# EAGLE design load-it (EAGLE 6.2)
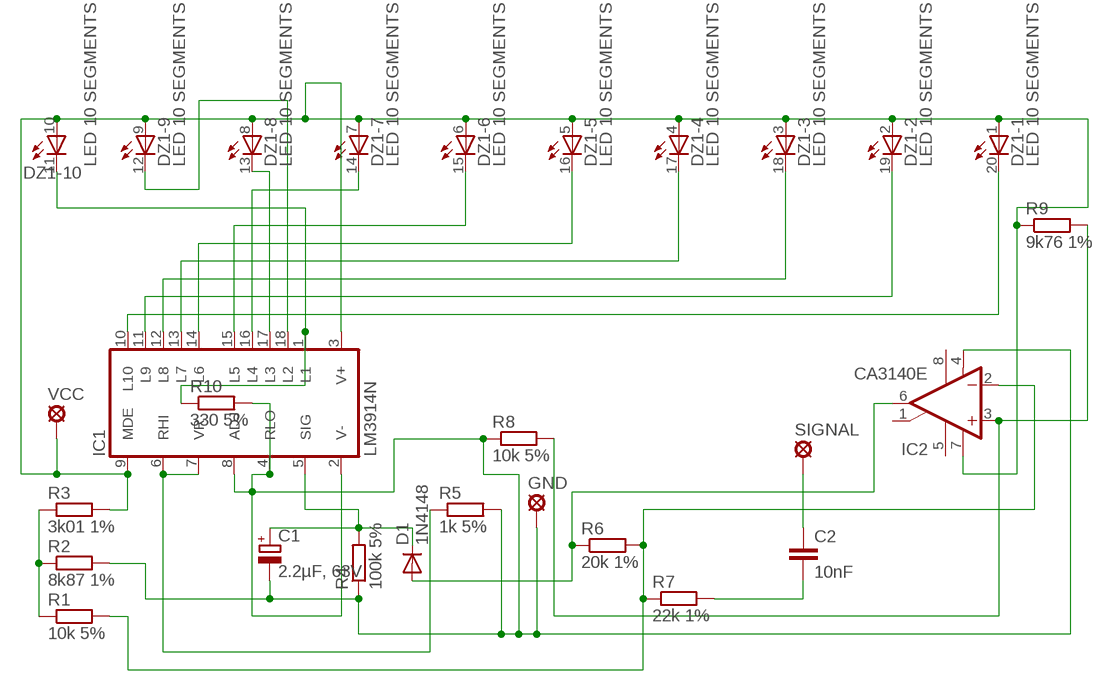
[diagram p0: schematic, sheet 1]

## Parts
C1  2.2µF, 63V  CPOL-EUE5-6  [E5-6]
C2  10nF  C2.5/2  [C2.5-2]
D1  1N4148  1N4148DO35-7  [DO35-7]
DZ1  LED 10 SEGMENTS  LB10  [LB10]
GND  GND  LSP10  [LSP10]
IC1  LM3914N  [DIL18]
IC2  CA3140E  CA3140N  [DIL08]
R1  10k 5%  R-EU_0207/10  [0207/10]
R2  8k87 1%  R-EU_0207/10  [0207/10]
R3  3k01 1%  R-EU_0207/10  [0207/10]
R4  100k 5%  R-EU_0207/10  [0207/10]
R5  1k 5%  R-EU_0207/10  [0207/10]
R6  20k 1%  R-EU_0207/10  [0207/10]
R7  22k 1%  R-EU_0207/10  [0207/10]
R8  10k 5%  R-EU_0207/10  [0207/10]
R9  9k76 1%  R-EU_0207/10  [0207/10]
R10  330 5%  R-EU_0207/10  [0207/10]
SIGNAL  SG  LSP10  [LSP10]
VCC  VCC  LSP10  [LSP10]

## Nets
N$1: DZ1.20(-1:C) IC1.10(L10)
N$2: IC2.2(-IN) R1.2 R6.2 R7.1
N$3: D1.A IC2.6(OUT) R6.1
N$5: IC2.3(+IN) R8.2 R9.2
N$7: C1.- GND.MP IC1.2(V-) IC1.4(RLO) IC1.8(ADJ) IC2.4(V-) R2.2 R4.1 R5.2 R8.1 R10.2
N$8: DZ1.1(-1:A) DZ1.2(-2:A) DZ1.3(-3:A) DZ1.4(-4:A) DZ1.5(-5:A) DZ1.6(-6:A) DZ1.7(-7:A) DZ1.8(-8:A) DZ1.9(-9:A) DZ1.10(-10:A) IC1.3(V+) IC1.9(MDE) IC2.7(V+) R3.2 R9.1 VCC.MP
N$9: C1.+ D1.C IC1.5(SIG) R4.2
N$10: IC1.6(RHI) IC1.7(VR) R5.1
N$11: DZ1.11(-10:C) IC1.1(L1) R10.1
N$12: DZ1.19(-2:C) IC1.11(L9)
N$13: DZ1.18(-3:C) IC1.12(L8)
N$14: DZ1.17(-4:C) IC1.13(L7)
N$15: DZ1.16(-5:C) IC1.14(L6)
N$16: DZ1.15(-6:C) IC1.15(L5)
N$17: DZ1.14(-7:C) IC1.16(L4)
N$18: DZ1.13(-8:C) IC1.17(L3)
N$19: DZ1.12(-9:C) IC1.18(L2)
N$20: R1.1 R2.1 R3.1
N$23: C2.2 R7.2
N$24: C2.1 SIGNAL.MP
Unconnected: IC2.1(ON/CMP) IC2.5(ON) IC2.8(CMP)

## Library data of the parts
C1 = rcl:CPOL-EU: POLARIZED CAPACITOR, European symbol
C2 = capacitor-wima:C: CAPACITOR naming: grid - package width
D1 = diode:1N4148: DIODE high speed (Philips)
DZ1 = led:LB10: LED BLOCK 10-LED bar graph, DIL, Siemens
GND SIGNAL VCC = solpad:LSP10: SOLDER PAD drill 1.0 mm, distributor Buerklin, 12H555
IC1 = linear:LM3914N: LED DRIVER senses analog voltage levels and drives 10 LEDs
IC2 = linear:CA3140: OP AMP
R1-R10 = rcl:R-EU_: RESISTOR, European symbol

## Board
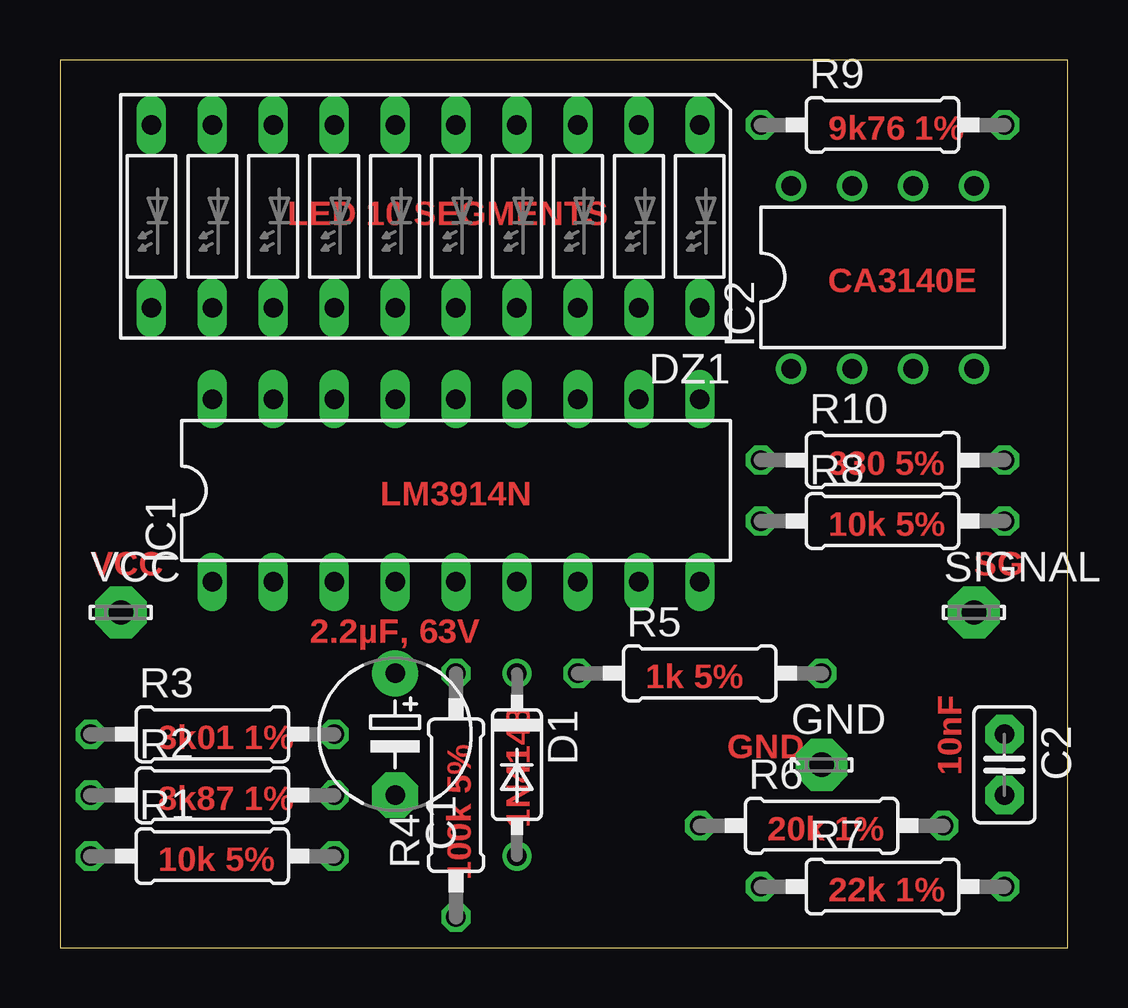
[diagram p1: board, top side]
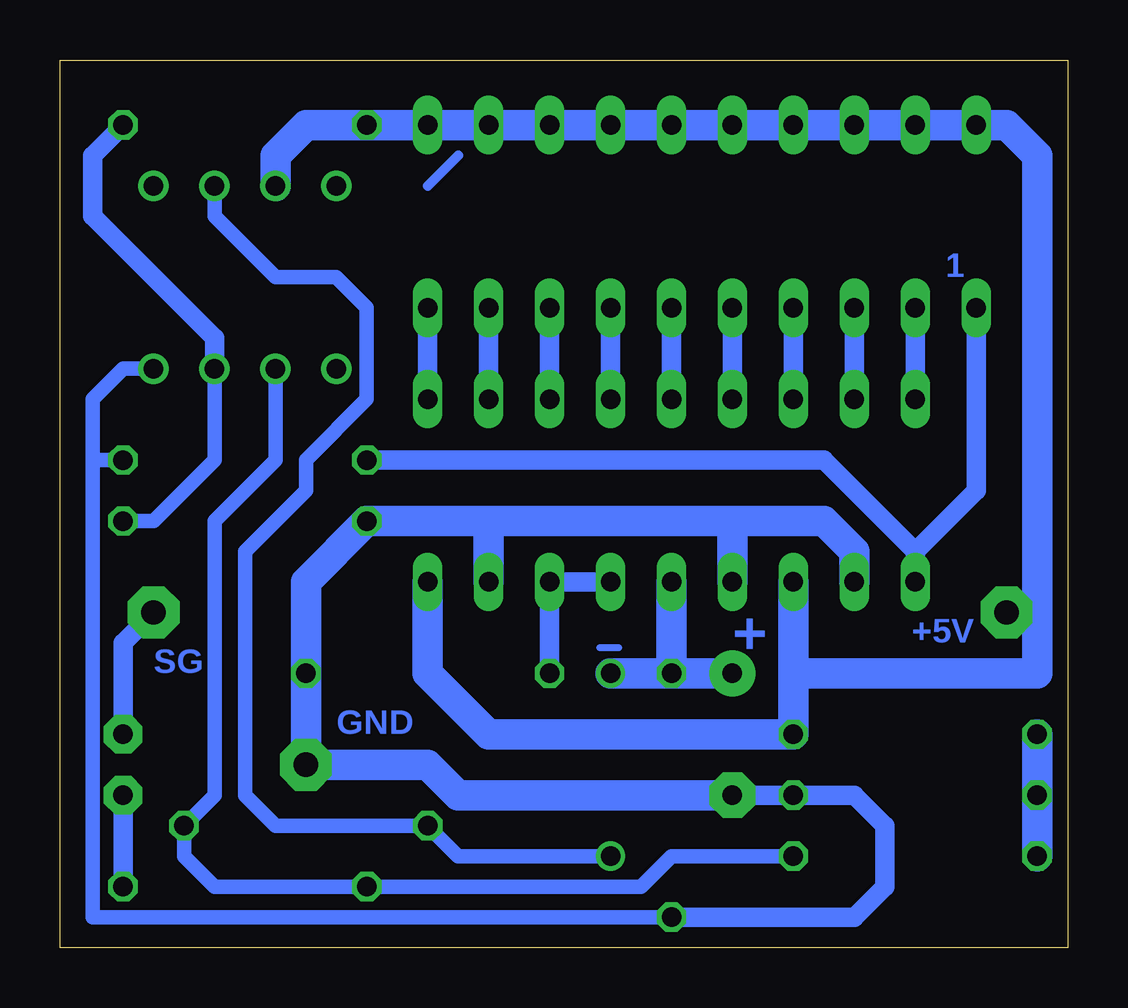
[diagram p2: board, bottom side, seen from below]

Size 42 x 37 mm. Coordinates in mm from the lower left corner, seen from the top.
Outline: 0,0 42,0 42,37 0,37 0,0
Copper layers (1*16): Top 0.0356mm / dielectric 1.5011mm / Bottom 0.0356mm
Design rules: minimum track width 0.15mm, minimum drill 0.3mm, track to track 0.15mm, track to pad 0.15mm, pad to pad 0.15mm, via to via 0.15mm, smd to smd 0.15mm, copper to edge 10mil, drill to drill 0.5mm, minimum pad ring 0.15mm, minimum via ring 0.15mm, stop-mask expansion 0mil, vias tented up to drill 0mil, thermal gap 10mil

### Footprints (pad centres in the part's own frame; a part is rotated, then mirrored left to right if it is on the bottom)
E5-6 = drill 0.813 pad 1.905: + -2.54,0 | drill 0.813 pad 1.905 octagon: - 2.54,0
C2.5-2 = drill 0.813 pad 1.6 octagon: 1 -1.27,0; 2 1.27,0
DO35-7 = drill 0.813: A 3.81,0; C -3.81,0
LB10 = drill 0.813 long: 1 -11.43,-3.81; 2 -8.89,-3.81; 3 -6.35,-3.81; 4 -3.81,-3.81; 5 -1.27,-3.81; 6 1.27,-3.81; 7 3.81,-3.81; 8 6.35,-3.81; 9 8.89,-3.81; 10 11.43,-3.81; 11 11.43,3.81; 12 8.89,3.81; 13 6.35,3.81; 14 3.81,3.81; 15 1.27,3.81; 16 -1.27,3.81; 17 -3.81,3.81; 18 -6.35,3.81; 19 -8.89,3.81; 20 -11.43,3.81
LSP10 = drill 1.016 pad 2.159 octagon: MP 0,0
DIL18 = drill 0.813 long: 1 -10.16,-3.81; 2 -7.62,-3.81; 3 -5.08,-3.81; 4 -2.54,-3.81; 5 0,-3.81; 6 2.54,-3.81; 7 5.08,-3.81; 8 7.62,-3.81; 9 10.16,-3.81; 10 10.16,3.81; 11 7.62,3.81; 12 5.08,3.81; 13 2.54,3.81; 14 0,3.81; 15 -2.54,3.81; 16 -5.08,3.81; 17 -7.62,3.81; 18 -10.16,3.81
DIL08 = drill 0.813 pad 1.27: 1 -3.81,-3.81; 2 -1.27,-3.81; 3 1.27,-3.81; 4 3.81,-3.81; 5 3.81,3.81; 6 1.27,3.81; 7 -1.27,3.81; 8 -3.81,3.81
0207/10 = drill 0.813 octagon: 1 -5.08,0; 2 5.08,0

### Placement (x,y rotation side)
C1  13.97,8.89 270 top
C2  39.37,7.62 270 top
D1  19.05,7.62 270 top
DZ1  15.24,30.48 180 top
GND  31.75,7.62 0 top
IC1  16.51,19.05 0 top
IC2  34.29,27.94 0 top
R1  6.35,3.81 0 top
R2  6.35,6.35 0 top
R3  6.35,8.89 0 top
R4  16.51,6.35 90 top
R5  26.67,11.43 0 top
R6  31.75,5.08 0 top
R7  34.29,2.54 0 top
R8  34.29,17.78 0 top
R9  34.29,34.29 0 top
R10  34.29,20.32 0 top
SIGNAL  38.1,13.97 0 top
VCC  2.54,13.97 0 top

### Tracks (layer width: path | path; a pad name or v marks a point on that pad's centre or on a via)
N$1
  Bottom 0.813: IC1.10 DZ1.20
N$2
  Bottom 0.61: R1.2 16.51,3.81 17.78,2.54 R7.1 35.56,2.54 36.83,3.81 R6.2 35.56,6.35 35.56,17.78 33.02,20.32 IC2.2
N$3
  Bottom 0.61: IC2.6 35.56,30.48 33.02,27.94 30.48,27.94 29.21,26.67 29.21,22.86 31.75,20.32 31.75,19.05 34.29,16.51 34.29,6.35 33.02,5.08 R6.1 25.4,3.81 D1.A
N$4
  Bottom 0.406: 26.67,31.75 25.4,33.02
N$5
  Bottom 0.61: IC2.3 35.56,20.32 38.1,17.78 R8.2
  Bottom 0.813: IC2.3 35.56,25.4 40.64,30.48 40.64,33.02 R9.2
N$7
  Bottom 0.61: 40.64,20.32 40.64,22.86 39.37,24.13 IC2.4 | 40.64,20.32 40.64,1.27 R4.1 | R10.2 40.64,20.32
  Bottom 0.813: R4.1 8.89,1.27 7.62,2.54 7.62,5.08 8.89,6.35 R2.2 C1.-
  Bottom 1.27: IC1.2 8.89,16.51 10.16,17.78 13.97,17.78 | 13.97,16.51 IC1.4 13.97,17.78 | IC1.8 24.13,17.78 | 24.13,17.78 13.97,17.78 | 24.13,17.78 R8.1 31.75,15.24 R5.2 GND.MP 26.67,7.62 25.4,6.35 C1.-
N$8
  Bottom 1.27: 1.27,13.97 1.27,33.02 2.54,34.29 DZ1.10 DZ1.9 DZ1.8 DZ1.7 DZ1.6 DZ1.5 DZ1.4 DZ1.3 DZ1.2 DZ1.1 R9.1 31.75,34.29 33.02,33.02 IC2.7 | 1.27,13.97 VCC.MP | 11.43,11.43 R3.2 24.13,8.89 26.67,11.43 IC1.9 | 11.43,11.43 IC1.3 | 1.27,13.97 1.27,11.43 11.43,11.43
N$9
  Bottom 1.27: R4.2 IC1.5 | D1.C R4.2 | R4.2 C1.+
N$10
  Bottom 0.813: R5.1 IC1.7 IC1.6
N$11
  Bottom 0.813: DZ1.11 3.81,19.05 6.35,16.51 | 6.35,16.51 IC1.1 | 6.35,16.51 10.16,20.32 R10.1
N$12
  Bottom 0.813: IC1.11 DZ1.19
N$13
  Bottom 0.813: DZ1.18 IC1.12
N$14
  Bottom 0.813: IC1.13 DZ1.17
N$15
  Bottom 0.813: DZ1.16 IC1.14
N$16
  Bottom 0.813: IC1.15 DZ1.15
N$17
  Bottom 0.813: DZ1.14 IC1.16
N$18
  Bottom 0.813: IC1.17 DZ1.13
N$19
  Bottom 0.813: DZ1.12 IC1.18
N$20
  Bottom 1.27: R3.1 R2.1 R1.1
N$21
  Bottom 0.3: 18.7,12.5 19.5,12.5
N$23
  Bottom 0.813: R7.2 C2.2
N$24
  Bottom 0.813: C2.1 39.37,12.7 SIGNAL.MP

### Text on the board
Bottom: 1 | +5V | + | SG | GND